# EAGLE design drumuino (EAGLE 7.6.0)
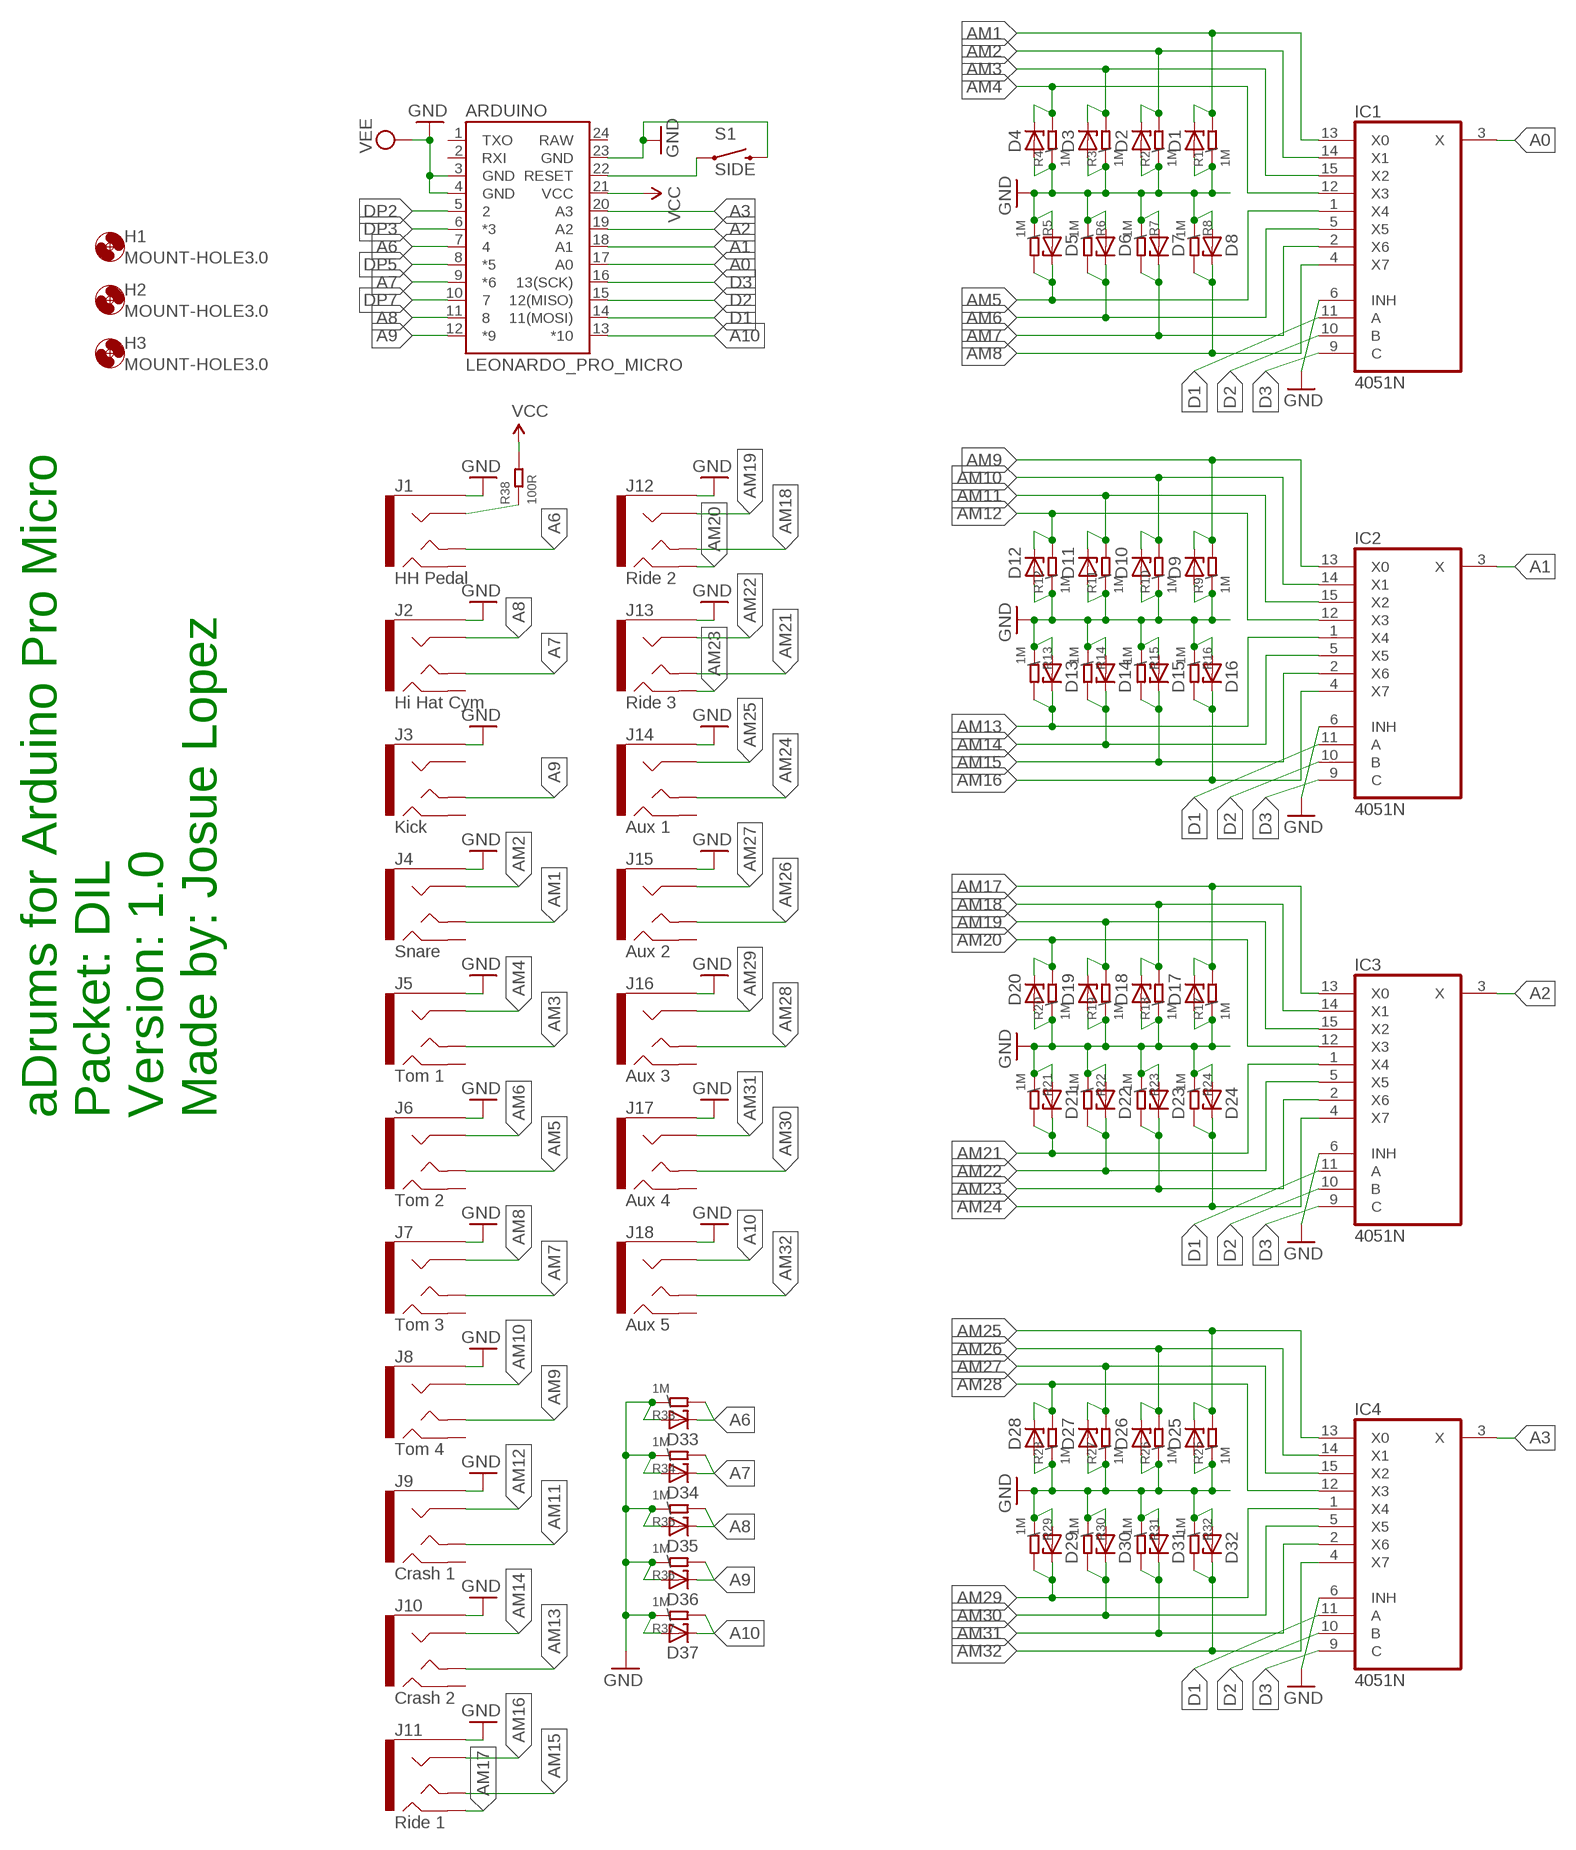
[diagram p0: schematic, sheet 1]

## Parts
ARDUINO  LEONARDO_PRO_MICRO  ARDUINO_PRO_MICRO  [ARDUINO_PRO_MICRO]
D1  \  ZENER-DIODEDO41-7.6  [DO41-7.6]
D2  \  ZENER-DIODEDO41-7.6  [DO41-7.6]
D3  \  ZENER-DIODEDO41-7.6  [DO41-7.6]
D4  \  ZENER-DIODEDO41-7.6  [DO41-7.6]
D5  \  ZENER-DIODEDO41-7.6  [DO41-7.6]
D6  \  ZENER-DIODEDO41-7.6  [DO41-7.6]
D7  \  ZENER-DIODEDO41-7.6  [DO41-7.6]
D8  \  ZENER-DIODEDO41-7.6  [DO41-7.6]
D9  \  ZENER-DIODEDO41-7.6  [DO41-7.6]
D10  \  ZENER-DIODEDO41-7.6  [DO41-7.6]
D11  \  ZENER-DIODEDO41-7.6  [DO41-7.6]
D12  \  ZENER-DIODEDO41-7.6  [DO41-7.6]
D13  \  ZENER-DIODEDO41-7.6  [DO41-7.6]
D14  \  ZENER-DIODEDO41-7.6  [DO41-7.6]
D15  \  ZENER-DIODEDO41-7.6  [DO41-7.6]
D16  \  ZENER-DIODEDO41-7.6  [DO41-7.6]
D17  \  ZENER-DIODEDO41-7.6  [DO41-7.6]
D18  \  ZENER-DIODEDO41-7.6  [DO41-7.6]
D19  \  ZENER-DIODEDO41-7.6  [DO41-7.6]
D20  \  ZENER-DIODEDO41-7.6  [DO41-7.6]
D21  \  ZENER-DIODEDO41-7.6  [DO41-7.6]
D22  \  ZENER-DIODEDO41-7.6  [DO41-7.6]
D23  \  ZENER-DIODEDO41-7.6  [DO41-7.6]
D24  \  ZENER-DIODEDO41-7.6  [DO41-7.6]
D25  \  ZENER-DIODEDO41-7.6  [DO41-7.6]
D26  \  ZENER-DIODEDO41-7.6  [DO41-7.6]
D27  \  ZENER-DIODEDO41-7.6  [DO41-7.6]
D28  \  ZENER-DIODEDO41-7.6  [DO41-7.6]
D29  \  ZENER-DIODEDO41-7.6  [DO41-7.6]
D30  \  ZENER-DIODEDO41-7.6  [DO41-7.6]
D31  \  ZENER-DIODEDO41-7.6  [DO41-7.6]
D32  \  ZENER-DIODEDO41-7.6  [DO41-7.6]
D33  \  ZENER-DIODEDO41-7.6  [DO41-7.6]
D34  \  ZENER-DIODEDO41-7.6  [DO41-7.6]
D35  \  ZENER-DIODEDO41-7.6  [DO41-7.6]
D36  \  ZENER-DIODEDO41-7.6  [DO41-7.6]
D37  \  ZENER-DIODEDO41-7.6  [DO41-7.6]
H1  MOUNT-HOLE3.0  [3,0]
H2  MOUNT-HOLE3.0  [3,0]
H3  MOUNT-HOLE3.0  [3,0]
IC1  4051N  [DIL16]
IC2  4051N  [DIL16]
IC3  4051N  [DIL16]
IC4  4051N  [DIL16]
J1  HH Pedal  AUDIO-JACK3'DIL'  [AUDIO-JACK-TRRS-DIL]
J2  Hi Hat Cym  AUDIO-JACK3'DIL'  [AUDIO-JACK-TRRS-DIL]
J3  Kick  AUDIO-JACK3'DIL'  [AUDIO-JACK-TRRS-DIL]
J4  Snare  AUDIO-JACK3'DIL'  [AUDIO-JACK-TRRS-DIL]
J5  Tom 1  AUDIO-JACK3'DIL'  [AUDIO-JACK-TRRS-DIL]
J6  Tom 2  AUDIO-JACK3'DIL'  [AUDIO-JACK-TRRS-DIL]
J7  Tom 3  AUDIO-JACK3'DIL'  [AUDIO-JACK-TRRS-DIL]
J8  Tom 4  AUDIO-JACK3'DIL'  [AUDIO-JACK-TRRS-DIL]
J9  Crash 1  AUDIO-JACK3'DIL'  [AUDIO-JACK-TRRS-DIL]
J10  Crash 2  AUDIO-JACK3'DIL'  [AUDIO-JACK-TRRS-DIL]
J11  Ride 1  AUDIO-JACK3'DIL'  [AUDIO-JACK-TRRS-DIL]
J12  Ride 2  AUDIO-JACK3'DIL'  [AUDIO-JACK-TRRS-DIL]
J13  Ride 3  AUDIO-JACK3'DIL'  [AUDIO-JACK-TRRS-DIL]
J14  Aux 1  AUDIO-JACK3'DIL'  [AUDIO-JACK-TRRS-DIL]
J15  Aux 2  AUDIO-JACK3'DIL'  [AUDIO-JACK-TRRS-DIL]
J16  Aux 3  AUDIO-JACK3'DIL'  [AUDIO-JACK-TRRS-DIL]
J17  Aux 4  AUDIO-JACK3'DIL'  [AUDIO-JACK-TRRS-DIL]
J18  Aux 5  AUDIO-JACK3'DIL'  [AUDIO-JACK-TRRS-DIL]
R1  1M  RES-0207/7  [R0207_7]
R2  1M  RES-0207/7  [R0207_7]
R3  1M  RES-0207/7  [R0207_7]
R4  1M  RES-0207/7  [R0207_7]
R5  1M  RES-0207/7  [R0207_7]
R6  1M  RES-0207/7  [R0207_7]
R7  1M  RES-0207/7  [R0207_7]
R8  1M  RES-0207/7  [R0207_7]
R9  1M  RES-0207/7  [R0207_7]
R10  1M  RES-0207/7  [R0207_7]
R11  1M  RES-0207/7  [R0207_7]
R12  1M  RES-0207/7  [R0207_7]
R13  1M  RES-0207/7  [R0207_7]
R14  1M  RES-0207/7  [R0207_7]
R15  1M  RES-0207/7  [R0207_7]
R16  1M  RES-0207/7  [R0207_7]
R17  1M  RES-0207/7  [R0207_7]
R18  1M  RES-0207/7  [R0207_7]
R19  1M  RES-0207/7  [R0207_7]
R20  1M  RES-0207/7  [R0207_7]
R21  1M  RES-0207/7  [R0207_7]
R22  1M  RES-0207/7  [R0207_7]
R23  1M  RES-0207/7  [R0207_7]
R24  1M  RES-0207/7  [R0207_7]
R25  1M  RES-0207/7  [R0207_7]
R26  1M  RES-0207/7  [R0207_7]
R27  1M  RES-0207/7  [R0207_7]
R28  1M  RES-0207/7  [R0207_7]
R29  1M  RES-0207/7  [R0207_7]
R30  1M  RES-0207/7  [R0207_7]
R31  1M  RES-0207/7  [R0207_7]
R32  1M  RES-0207/7  [R0207_7]
R33  1M  RES-0207/7  [R0207_7]
R34  1M  RES-0207/7  [R0207_7]
R35  1M  RES-0207/7  [R0207_7]
R36  1M  RES-0207/7  [R0207_7]
R37  1M  RES-0207/7  [R0207_7]
R38  100R  RES-0207/7  [R0207_7]
S1  SIDE  SWITCH-MOMENTARY-2SIDE_EZ  [TACTILE-PTH-SIDEEZ]

## Nets
A0: ARDUINO.17(A0) IC1.3(X)
A1: ARDUINO.18(A1) IC2.3(X)
A2: ARDUINO.19(A2) IC3.3(X)
A3: ARDUINO.20(A3) IC4.3(X)
A6: ARDUINO.7 D33.C J1.TIP R33.2
A7: ARDUINO.9(*6) D34.C J2.TIP R34.2
A8: ARDUINO.11 D35.C J2.RING1 R35.2
A9: ARDUINO.12(*9) D36.C J3.TIP R36.2
A10: ARDUINO.13(*10) D37.C J18.RING1 R37.2
AM1: D1.C IC1.13(X0) J4.TIP R1.2
AM2: D2.C IC1.14(X1) J4.RING1 R2.2
AM3: D3.C IC1.15(X2) J5.TIP R3.2
AM4: D4.C IC1.12(X3) J5.RING1 R4.2
AM5: D5.C IC1.1(X4) J6.TIP R5.2
AM6: D6.C IC1.5(X5) J6.RING1 R6.2
AM7: D7.C IC1.2(X6) J7.TIP R7.2
AM8: D8.C IC1.4(X7) J7.RING1 R8.2
AM9: D9.C IC2.13(X0) J8.TIP R9.2
AM10: D10.C IC2.14(X1) J8.RING1 R10.2
AM11: D11.C IC2.15(X2) J9.TIP R11.2
AM12: D12.C IC2.12(X3) J9.RING1 R12.2
AM13: D13.C IC2.1(X4) J10.TIP R13.2
AM14: D14.C IC2.5(X5) J10.RING1 R14.2
AM15: D15.C IC2.2(X6) J11.TIP R15.2
AM16: D16.C IC2.4(X7) J11.RING1 R16.2
AM17: D17.C IC3.13(X0) J11.RING2 R17.2
AM18: D18.C IC3.14(X1) J12.TIP R18.2
AM19: D19.C IC3.15(X2) J12.RING1 R19.2
AM20: D20.C IC3.12(X3) J12.RING2 R20.2
AM21: D21.C IC3.1(X4) J13.TIP R21.2
AM22: D22.C IC3.5(X5) J13.RING1 R22.2
AM23: D23.C IC3.2(X6) J13.RING2 R23.2
AM24: D24.C IC3.4(X7) J14.TIP R24.2
AM25: D25.C IC4.13(X0) J14.RING1 R25.2
AM26: D26.C IC4.14(X1) J15.TIP R26.2
AM27: D27.C IC4.15(X2) J15.RING1 R27.2
AM28: D28.C IC4.12(X3) J16.TIP R28.2
AM29: D29.C IC4.1(X4) J16.RING1 R29.2
AM30: D30.C IC4.5(X5) J17.TIP R30.2
AM31: D31.C IC4.2(X6) J17.RING1 R31.2
AM32: D32.C IC4.4(X7) J18.TIP R32.2
D1: ARDUINO.14(11(MOSI)) IC1.11(A) IC2.11(A) IC3.11(A) IC4.11(A)
D2: ARDUINO.15(12(MISO)) IC1.10(B) IC2.10(B) IC3.10(B) IC4.10(B)
D3: ARDUINO.16(13(SCK)) IC1.9(C) IC2.9(C) IC3.9(C) IC4.9(C)
DP2: ARDUINO.5
DP3: ARDUINO.6(*3)
DP5: ARDUINO.8(*5)
DP7: ARDUINO.10
GND [Supply]: ARDUINO.3(GND) ARDUINO.4(GND) ARDUINO.23(GND) D1.A D2.A D3.A D4.A D5.A D6.A D7.A D8.A D9.A D10.A D11.A D12.A D13.A D14.A D15.A D16.A D17.A D18.A D19.A D20.A D21.A D22.A D23.A D24.A D25.A D26.A D27.A D28.A D29.A D30.A D31.A D32.A D33.A D34.A D35.A D36.A D37.A IC1.6(INH) IC2.6(INH) IC3.6(INH) IC4.6(INH) J1.2EARTH(EARTH) J1.EARTH J2.2EARTH(EARTH) J2.EARTH J3.2EARTH(EARTH) J3.EARTH J4.2EARTH(EARTH) J4.EARTH J5.2EARTH(EARTH) J5.EARTH J6.2EARTH(EARTH) J6.EARTH J7.2EARTH(EARTH) J7.EARTH J8.2EARTH(EARTH) J8.EARTH J9.2EARTH(EARTH) J9.EARTH J10.2EARTH(EARTH) J10.EARTH J11.2EARTH(EARTH) J11.EARTH J12.2EARTH(EARTH) J12.EARTH J13.2EARTH(EARTH) J13.EARTH J14.2EARTH(EARTH) J14.EARTH J15.2EARTH(EARTH) J15.EARTH J16.2EARTH(EARTH) J16.EARTH J17.2EARTH(EARTH) J17.EARTH J18.2EARTH(EARTH) J18.EARTH R1.1 R2.1 R3.1 R4.1 R5.1 R6.1 R7.1 R8.1 R9.1 R10.1 R11.1 R12.1 R13.1 R14.1 R15.1 R16.1 R17.1 R18.1 R19.1 R20.1 R21.1 R22.1 R23.1 R24.1 R25.1 R26.1 R27.1 R28.1 R29.1 R30.1 R31.1 R32.1 R33.1 R34.1 R35.1 R36.1 R37.1 S1.2 ; supply symbol labelled VEE
HHC_TIP: J1.RING1 R38.1
N$1: ARDUINO.22(RESET) S1.1
VCC [Supply]: ARDUINO.21(VCC) R38.2
Unconnected: ARDUINO.1(TXO) ARDUINO.2(RXI) ARDUINO.24(RAW) J1.RING2 J2.RING2 J3.RING1 J3.RING2 J4.RING2 J5.RING2 J6.RING2 J7.RING2 J8.RING2 J9.RING2 J10.RING2 J14.RING2 J15.RING2 J16.RING2 J17.RING2 J18.RING2

## Notes on the sheet
- aDrums for Arduino Pro Micro
  Packet: DIL
  Version: 1.0
  Made by: Josue Lopez

## Power pins joined to a net without a drawn wire
GND: IC1.7(VEE) IC1.8(GND) IC2.7(VEE) IC2.8(GND) IC3.7(VEE) IC3.8(GND) IC4.7(VEE) IC4.8(GND)
VCC: IC1.16(VCC) IC2.16(VCC) IC3.16(VCC) IC4.16(VCC)

## Library data of the parts
ARDUINO = SparkFun-Boards:ARDUINO_PRO_MICRO
D1-D37 = diode:ZENER-DIODE: Z-Diode
H1-H3 = holes:MOUNT-HOLE: MOUNTING HOLE with drill center marker
IC1-IC4 = 40xx:4051: 8-channel ANALOG MULTIPLEXER
J1-J18 = SparkFun-Connectors:AUDIO-JACK3: 3.5mm Female Audio Connector 6 Pin DIP Stereo Headphone Jack PJ-313B
R1-R38 = Seeed-OPL-Resistor:RES
S1 = SparkFun-Electromechanical:SWITCH-MOMENTARY-2: Various NO switches- pushbuttons, reed, etc

## Net classes
0 default: width 0.635 mm
1 Supply: width 1.016 mm

## Board
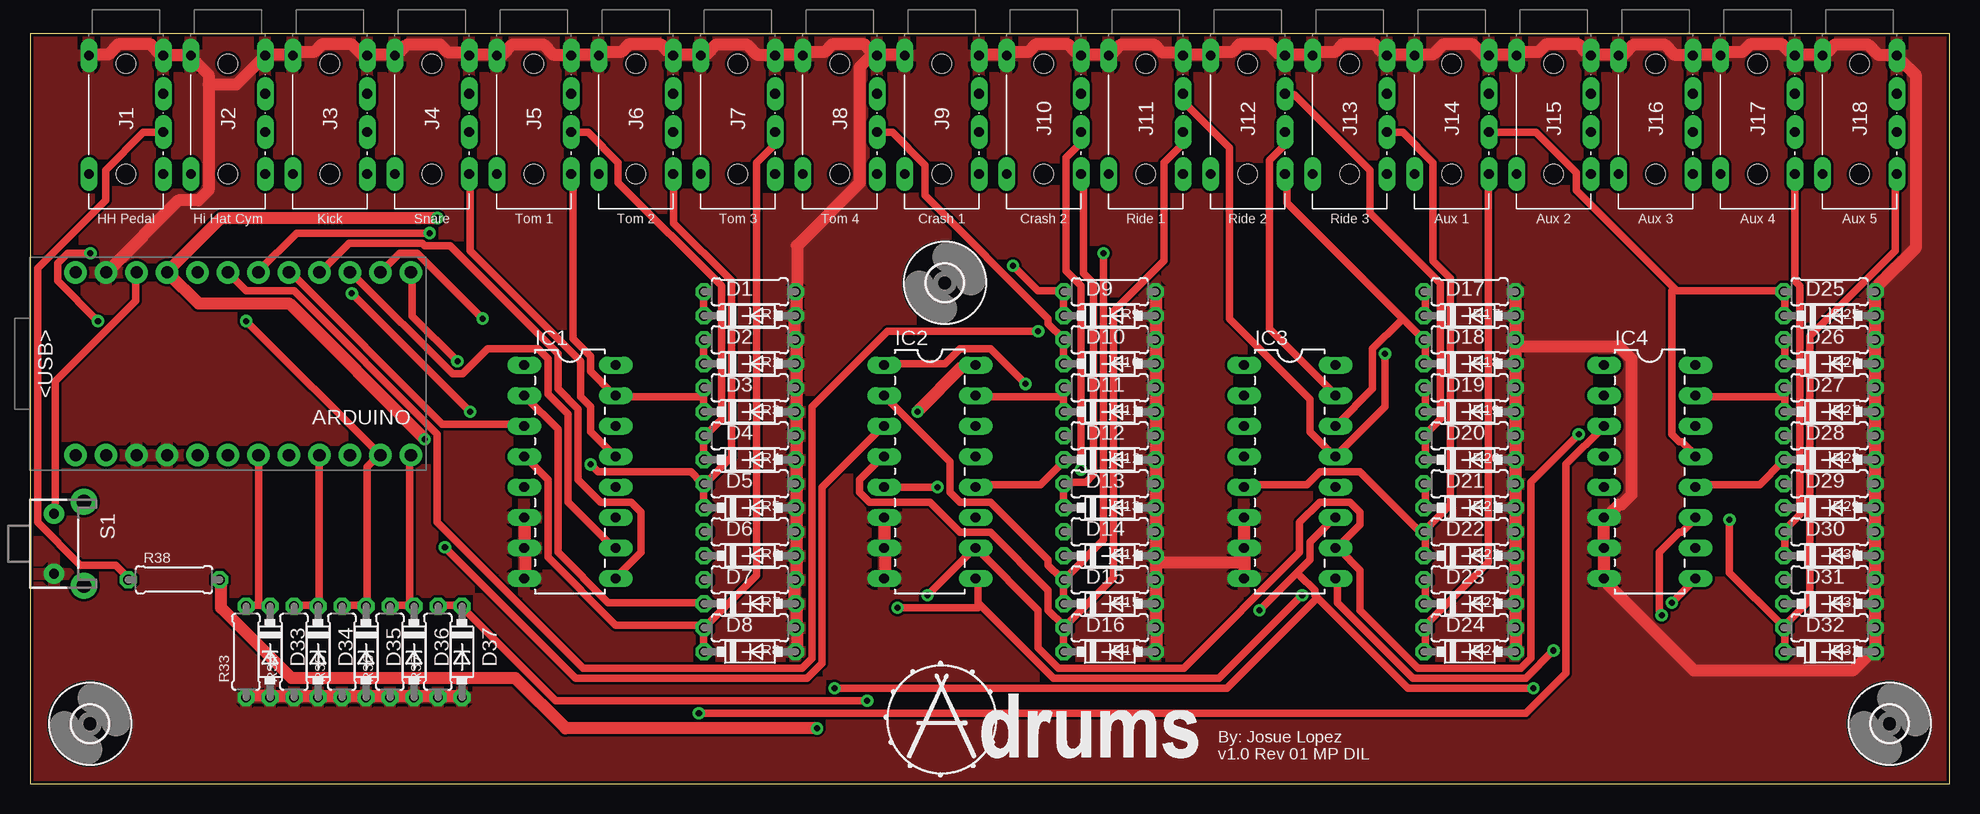
[diagram p1: board, top side]
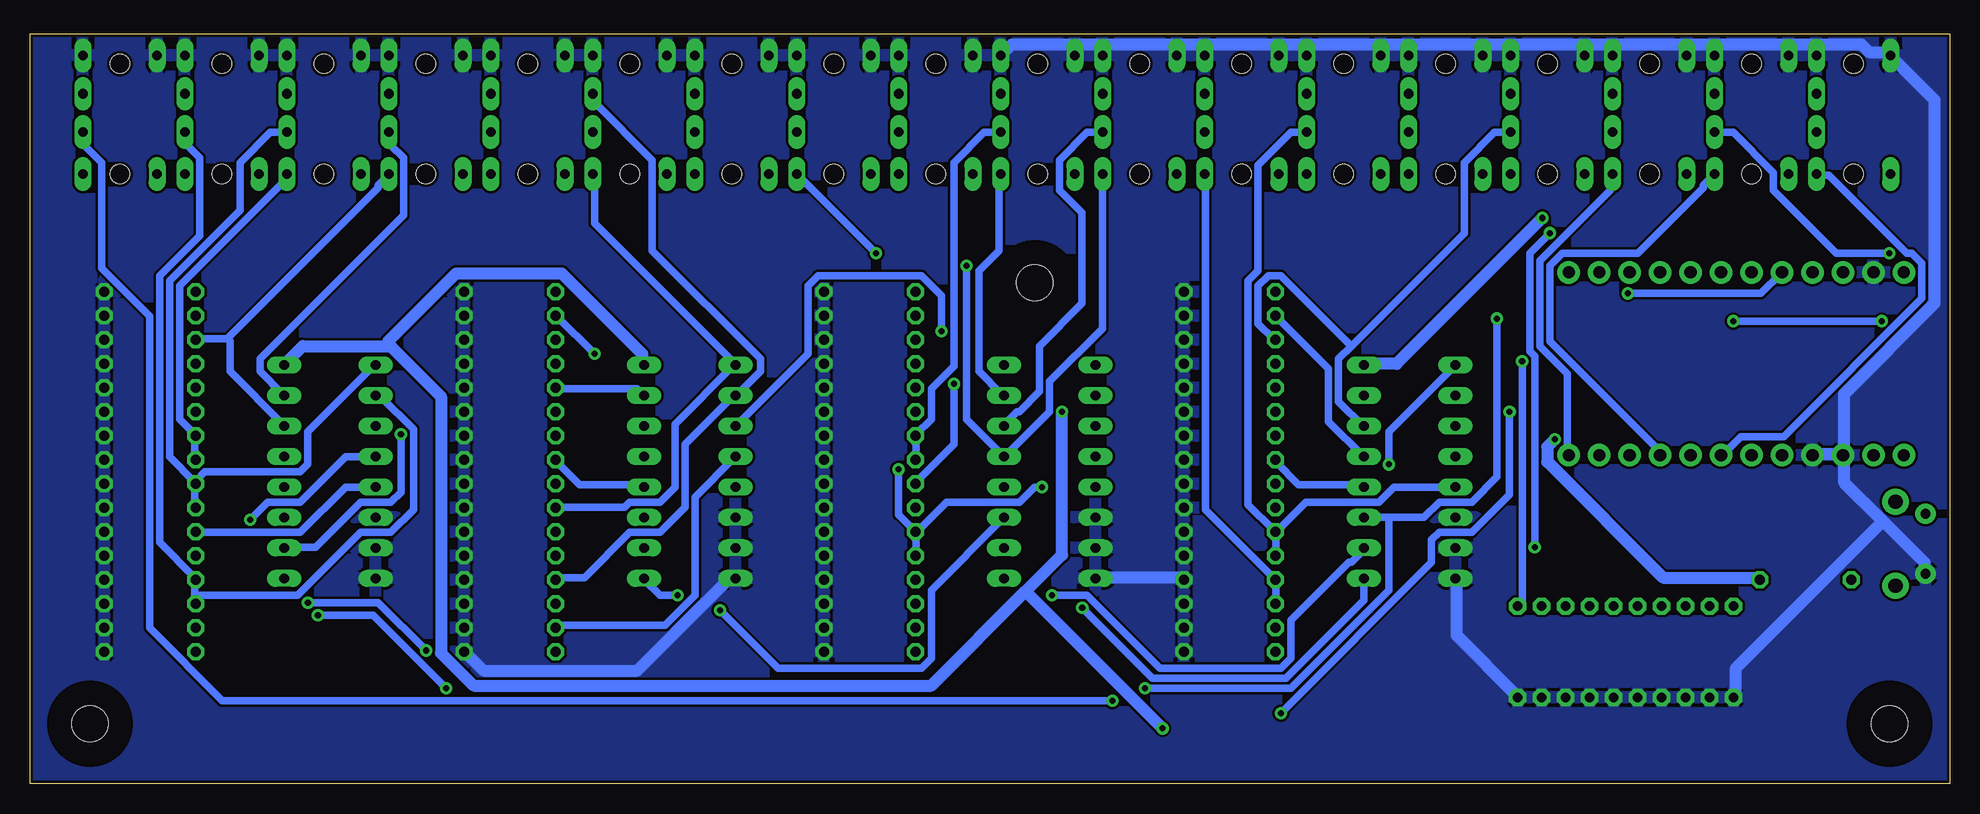
[diagram p2: board, bottom side, seen from below]

Size 160 x 62.5 mm. Coordinates in mm from the lower left corner, seen from the top.
Outline: 0,0 160,0 160,62.5 0,62.5 0,0
Copper layers (1*16): Top 0.035mm / dielectric 1.5mm / Bottom 0.035mm
Design rules "SparkFun": minimum track width 8mil, minimum drill 20mil, track to track 8mil, track to pad 8mil, pad to pad 8mil, via to via 8mil, smd to smd 8mil, copper to edge 10mil, drill to drill 8mil, minimum pad ring 12mil, minimum via ring 10mil, stop-mask expansion 4mil, vias tented up to drill 25mil, thermal gap 10mil

### Footprints (pad centres in the part's own frame; a part is rotated, then mirrored left to right if it is on the bottom)
ARDUINO_PRO_MICRO = drill 1.016 pad 1.88: 1 -7.62,12.7; 2 -7.62,10.16; 3 -7.62,7.62; 4 -7.62,5.08; 5 -7.62,2.54; 6 -7.62,0; 7 -7.62,-2.54; 8 -7.62,-5.08; 9 -7.62,-7.62; 10 -7.62,-10.16; 11 -7.62,-12.7; 12 -7.62,-15.24; 13 7.62,-15.24; 14 7.62,-12.7; 15 7.62,-10.16; 16 7.62,-7.62; 17 7.62,-5.08; 18 7.62,-2.54; 19 7.62,0; 20 7.62,2.54; 21 7.62,5.08; 22 7.62,7.62; 23 7.62,10.16; 24 7.62,12.7
DO41-7.6 = drill 0.813 octagon: A 3.81,0; C -3.81,0
3,0 = hole 3: 0,0
DIL16 = drill 0.813 long: 1 -8.89,-3.81; 2 -6.35,-3.81; 3 -3.81,-3.81; 4 -1.27,-3.81; 5 1.27,-3.81; 6 3.81,-3.81; 7 6.35,-3.81; 8 8.89,-3.81; 9 8.89,3.81; 10 6.35,3.81; 11 3.81,3.81; 12 1.27,3.81; 13 -1.27,3.81; 14 -3.81,3.81; 15 -6.35,3.81; 16 -8.89,3.81
AUDIO-JACK-TRRS-DIL = drill 0.8 long: 2EARTH 1.8,-3.1; 2TIP 11.7,-3.1; EARTH 1.8,3.1; RING1 8.2,3.1; RING2 5,3.1; TIP 11.7,3.1 | hole 1.6: 2.5,0; 11.7,0
R0207_7 = drill 0.813 octagon: 1 -3.81,0; 2 3.81,0
TACTILE-PTH-SIDEEZ = drill 0.8 pad 1.7: 1 -2.5,0; 2 2.5,0 | drill 1.2 pad 2.2: ANCHOR1 -3.5,2.5; ANCHOR2 3.5,2.5

### Placement (x,y rotation side)
ARDUINO  16.5,35 90 top
D1  60,39 0 top
D2  60,35 0 top
D3  60,31 0 top
D4  60,27 0 top
D5  60,23 0 top
D6  60,19 0 top
D7  60,15 0 top
D8  60,11 0 top
D9  90,39 0 top
D10  90,35 0 top
D11  90,31 0 top
D12  90,27 0 top
D13  90,23 0 top
D14  90,19 0 top
D15  90,15 0 top
D16  90,11 0 top
D17  120,39 0 top
D18  120,35 0 top
D19  120,31 0 top
D20  120,27 0 top
D21  120,23 0 top
D22  120,19 0 top
D23  120,15 0 top
D24  120,11 0 top
D25  150,39 0 top
D26  150,35 0 top
D27  150,31 0 top
D28  150,27 0 top
D29  150,23 0 top
D30  150,19 0 top
D31  150,15 0 top
D32  150,11 0 top
D33  20,11 270 top
D34  24,11 270 top
D35  28,11 270 top
D36  32,11 270 top
D37  36,11 270 top
H1  5,5 0 top
H2  155,5 0 top
H3  76.25,41.74 0 top
IC1  45,26 270 top
IC2  75,26 270 top
IC3  105,26 270 top
IC4  135,26 270 top
J1  8,62.5 270 top
J2  16.5,62.5 270 top
J3  25,62.5 270 top
J4  33.5,62.5 270 top
J5  42,62.5 270 top
J6  50.5,62.5 270 top
J7  59,62.5 270 top
J8  67.5,62.5 270 top
J9  76,62.5 270 top
J10  84.5,62.5 270 top
J11  93,62.5 270 top
J12  101.5,62.5 270 top
J13  110,62.5 270 top
J14  118.5,62.5 270 top
J15  127,62.5 270 top
J16  135.5,62.5 270 top
J17  144,62.5 270 top
J18  152.5,62.5 270 top
R1  60,41 180 top
R2  60,37 180 top
R3  60,33 180 top
R4  60,29 180 top
R5  60,25 180 top
R6  60,21 180 top
R7  60,17 180 top
R8  60,13 180 top
R9  90,41 180 top
R10  90,37 180 top
R11  90,33 180 top
R12  90,29 180 top
R13  90,25 180 top
R14  90,21 180 top
R15  90,17 180 top
R16  90,13 180 top
R17  120,41 180 top
R18  120,37 180 top
R19  120,33 180 top
R20  120,29 180 top
R21  120,25 180 top
R22  120,21 180 top
R23  120,17 180 top
R24  120,13 180 top
R25  150,41 180 top
R26  150,37 180 top
R27  150,33 180 top
R28  150,29 180 top
R29  150,25 180 top
R30  150,21 180 top
R31  150,17 180 top
R32  150,13 180 top
R33  18,11 90 top
R34  22,11 90 top
R35  26,11 90 top
R36  30,11 90 top
R37  34,11 90 top
R38  12,17 0 top
S1  2,20 270 top

### Tracks (layer width: path | path; a pad name or v marks a point on that pad's centre or on a via)
A0
  Top 0.635: IC1.3 41.07,29.97 34.37,29.97 21.58,42.75 ARDUINO.17
A1  (via drill 0.51)
  Top 0.635: v34.58,19.7 45.47,8.8 64.75,8.8 66.01,10.06 66.01,24.73 71.04,29.76 IC2.3 | v33.32,45.89 22.21,45.89 19.07,42.75 ARDUINO.18
  Bottom 0.635: v34.58,19.7 34.58,35.62 34.99,36.04 34.99,44.22 v33.32,45.89
A2  (via drill 0.51)
  Top 0.635: v84.03,37.72 71.46,37.72 65.17,31.43 65.17,10.48 64.33,9.64 46.1,9.64 33.95,21.79 33.95,29.13 22,41.07 18.02,41.07 16.55,42.54 ARDUINO.19
  Bottom 0.635: v84.03,37.72 84.03,40.65 85.71,42.33 94.3,42.33 95.14,41.49 95.14,35.83 101,29.97 IC3.3
A3  (via drill 0.51)
  Top 0.635: v55.74,5.87 124.68,5.87 128.03,9.22 128.03,26.61 131.18,29.76 IC4.3 | v26.82,40.86 v36.67,31.01
  Bottom 0.635: v55.74,5.87 43.17,18.44 43.17,20.33 42.54,20.95 39.81,20.95 36.67,24.1 v36.67,31.01 | v26.82,40.86 15.72,40.86 14.04,42.54 ARDUINO.20
A6
  Top 0.635: 19.07,14.88 19.91,14.88 D33.C | 19.07,14.88 18.02,14.88 R33.2 | 19.07,14.88 19.07,15.09 19.07,27.24 ARDUINO.7
  Bottom 0.635: J1.TIP 10.9,50.71 10.06,50.71 3.56,44.22 3.14,44.22 2.31,43.38 2.31,40.44 13.83,28.92 17.39,28.92 18.86,27.45 ARDUINO.7
A7
  Top 0.635: R34.2 22,14.88 23.89,14.88 D34.C 24.1,15.09 24.1,27.24 ARDUINO.9
  Bottom 0.635: J2.TIP 19.7,50.71 20.54,49.87 20.54,49.66 25.98,44.22 32.27,44.22 33.32,43.17 33.32,36.88 24.31,27.87 24.31,27.45 ARDUINO.9
A8  (via drill 0.51)
  Top 0.635: R35.2 26.19,14.88 27.87,14.88 D35.C 28.08,15.09 28.08,26.4 28.92,27.24 ARDUINO.11 29.13,27.45 v18.02,38.56 | v5.03,44.22 3.14,44.22 2.31,43.38 2.31,41.91 v5.66,38.56
  Bottom 0.635: v5.03,44.22 9.43,44.22 14.67,49.45 14.67,50.92 18.02,54.27 19.49,54.27 J2.RING1 | v18.02,38.56 v5.66,38.56
A9
  Top 0.635: R36.2 30.18,14.88 31.85,14.88 D36.C 31.64,15.09 31.64,27.24 ARDUINO.12
  Bottom 0.635: J3.TIP 28.29,50.71 28.29,49.45 34.16,43.59 34.16,36.46 31.85,34.16 31.85,27.45 ARDUINO.12
A10  (via drill 0.51)
  Top 0.635: v69.78,6.92 43.8,6.92 36.04,14.67 D37.C 35.83,14.88 34.16,14.88 R37.2 | v35.62,35.2 31.85,38.98 31.85,42.54 ARDUINO.13
  Bottom 0.635: v69.78,6.92 143.96,6.92 150.04,12.99 150.04,38.98 154.02,42.96 154.02,51.76 155.49,53.23 155.49,54.27 J18.RING1 | v35.62,35.2 35.62,15.09 35.83,14.88 D37.C
AM1
  Top 0.635: D1.C 56.16,39.19 56.16,40.86 R1.2 | J4.TIP 36.67,50.71 36.67,44.42 45.89,35.2 45.89,32.27 46.73,31.43 46.73,29.34 48.62,27.45 IC1.13
  Bottom 0.635: D1.C 56.16,38.98 51.76,34.58 51.76,30.18 48.83,27.24 IC1.13
AM2
  Top 0.635: D2.C 56.16,35.2 56.16,36.88 R2.2
  Bottom 0.635: 49.87,36.46 50.92,35.41 50.92,31.85 48.83,29.76 IC1.14 | 49.87,36.46 40.44,45.89 40.44,51.76 37.93,54.27 36.67,54.27 J4.RING1 | R2.2 56.37,37.09 57.63,38.35 57.63,41.49 56.79,42.33 55.74,42.33 50.08,36.67 49.87,36.46
AM3
  Top 0.635: 56.16,32.27 56.16,32.9 R3.2 | 56.16,32.27 56.16,31.01 D3.C | J5.TIP 45.26,50.71 45.26,37.09 46.73,35.62 46.73,34.37 48.62,32.48 IC1.15 49.03,32.27 55.95,32.27 56.16,32.27
AM4
  Top 0.635: J5.RING1 45.26,54.27 46.52,54.27 49.03,51.76 49.03,50.08 57.63,41.49 57.63,30.39 56.37,29.13 R4.2 56.16,28.71 56.16,27.03 D4.C
  Bottom 0.635: IC1.12 48.83,24.94 54.27,24.94 56.16,26.82 D4.C
AM5  (via drill 0.51)
  Top 0.635: J6.TIP 53.65,50.71 53.65,46.73 58.46,41.91 58.46,27.24 56.37,25.15 R5.2 | D5.C 56.16,23.05 56.16,24.73 R5.2 | v46.73,26.61 47.36,25.98 55.11,25.98 55.95,25.15 R5.2
  Bottom 0.635: v46.73,26.61 46.73,29.34 41.28,34.78 IC1.1
AM6
  Bottom 0.635: J6.RING1 53.65,54.27 54.9,54.27 57.63,51.55 57.63,42.75 58.46,41.91 58.46,23.26 56.37,21.16 R6.2 | D6.C 56.16,19.07 56.16,20.75 R6.2 | IC1.5 41.28,24.73 46.31,24.73 47.57,23.47 53.65,23.47 55.95,21.16 R6.2
AM7
  Top 0.635: IC1.2 41.28,32.27 44.01,29.55 44.01,19.28 48.2,15.09 56.16,15.09 D7.C
  Bottom 0.635: J7.TIP 62.03,50.71 62.03,22.84 56.37,17.18 R7.2 56.16,16.76 56.16,15.09 D7.C
AM8
  Top 0.635: J7.RING1 62.03,54.27 62.03,53.23 60.56,51.76 60.56,17.39 56.37,13.2 R8.2 | IC1.4 41.28,27.24 43.17,25.36 43.17,18.86 48.83,13.2 55.95,13.2 R8.2 | D8.C 56.16,11.11 56.16,12.78 R8.2
AM9  (via drill 0.51)
  Top 0.635: D9.C 86.12,39.19 86.12,40.86 R9.2 85.92,41.07 84.03,41.07 v81.93,43.17
  Bottom 0.635: J8.TIP 70.62,50.71 70.62,37.93 75.02,33.53 75.02,31.01 78.79,27.24 IC2.13 79,27.45 81.93,30.39 v81.93,43.17
AM10
  Top 0.635: J8.RING1 70.62,54.27 71.88,54.27 74.6,51.55 74.6,49.03 84.87,38.77 84.87,38.35 86.12,37.09 R10.2 86.12,36.88 86.12,35.2 D10.C
  Bottom 0.635: IC2.14 78.79,29.97 77.74,31.01 77.53,31.01 75.86,32.69 75.86,36.46 72.3,40.02 72.3,47.57 74.18,49.45 74.18,51.97 71.88,54.27 70.62,54.27 J8.RING1
AM11
  Top 0.635: 86.12,32.27 86.12,32.9 R11.2 | 86.12,32.27 86.12,31.01 D11.C | 86.12,32.27 85.92,32.27 79,32.27 IC2.15
  Bottom 0.635: J9.TIP 79.21,50.71 79.21,44.42 80.89,42.75 80.89,34.37 79,32.48 IC2.15
AM12
  Top 0.635: IC2.12 79,24.94 84.24,24.94 86.12,26.82 D12.C
  Bottom 0.635: J9.RING1 79.21,54.27 80.47,54.27 82.98,51.76 82.98,34.78 84.87,32.9 84.87,30.39 86.12,29.13 R12.2 86.12,28.71 86.12,27.03 D12.C
AM13  (via drill 0.51)
  Top 0.635: J10.TIP 87.8,50.71 87.8,42.54 88.64,41.7 88.64,25.77 88.01,25.15 86.33,25.15 R13.2 86.12,24.73 86.12,23.05 D13.C | v82.98,33.32 80.05,36.25 77.53,36.25 76.28,34.99 71.25,34.99 IC2.1
  Bottom 0.635: v82.98,33.32 82.98,28.29 86.12,25.15 R13.2
AM14  (via drill 0.51)
  Top 0.635: v87.59,26.19 87.59,41.49 86.33,42.75 86.33,52.18 87.59,53.44 87.59,54.27 J10.RING1 | v75.65,24.73 71.25,24.73 IC2.5
  Bottom 0.635: v87.59,26.19 87.59,22.42 86.33,21.16 R14.2 | D14.C 86.12,19.07 86.12,20.75 R14.2 | v75.65,24.73 76.28,24.73 77.53,23.47 83.61,23.47 85.92,21.16 R14.2
AM15  (via drill 0.51)
  Top 0.635: v89.48,44.22 89.48,20.33 86.33,17.18 R15.2 | D15.C 86.12,15.09 86.12,16.76 R15.2 | IC2.2 71.25,32.27 76.69,26.82 76.69,24.31 77.53,23.47 80.05,23.47 84.87,18.65 84.87,18.23 85.92,17.18 R15.2
  Bottom 0.635: v89.48,44.22 95.97,50.71 J11.TIP
AM16
  Top 0.635: J11.RING1 95.97,54.27 95.97,53.23 94.51,51.76 94.51,43.59 90.32,39.4 90.32,17.18 86.33,13.2 R16.2 | D16.C 86.12,11.11 86.12,12.78 R16.2 | IC2.4 71.04,27.24 69.15,25.36 69.15,24.31 69.99,23.47 75.02,23.47 77.53,20.95 80.05,20.95 84.87,16.14 84.87,14.46 86.12,13.2 R16.2
AM17  (via drill 0.51)
  Top 0.635: D17.C 116.3,39.19 116.3,40.86 R17.2 | J11.RING2 96.18,57.42 96.18,56.79 99.95,53.02 99.95,38.77 106.66,32.06 106.66,29.34 108.76,27.24 IC3.13 108.97,27.45 112.95,31.43 v112.95,35.83
  Bottom 0.635: v112.95,35.83 116.09,38.98 D17.C
AM18
  Top 0.635: 114.41,38.77 116.09,37.09 R18.2 116.3,36.88 116.3,35.2 D18.C | 114.41,38.77 104.78,48.41 104.78,50.71 J12.TIP | IC3.14 108.97,29.97 111.9,32.9 111.9,36.25 114.2,38.56 114.41,38.77
AM19
  Top 0.635: D19.C 116.3,31.01 116.3,32.9 R19.2 | J12.RING1 104.56,54.27 104.56,53.23 103.31,51.97 103.31,37.93 108.76,32.48 IC3.15
  Bottom 0.635: R19.2 116.09,32.9 109.39,32.9 108.97,32.48 IC3.15
AM20
  Top 0.635: J12.RING2 104.78,57.42 105.4,57.42 111.69,51.13 111.69,47.57 117.56,41.7 117.56,30.39 116.3,29.13 R20.2 116.3,28.71 116.3,27.03 D20.C
  Bottom 0.635: IC3.12 108.97,24.94 114.2,24.94 116.09,26.82 D20.C
AM21
  Top 0.635: D21.C 116.3,23.05 116.3,24.94 R21.2
  Bottom 0.635: J13.TIP 112.95,50.71 112.95,46.73 101.21,34.99 IC3.1 101.42,34.78 106.24,29.97 106.24,24.73 107.5,23.47 110.01,23.47 110.43,23.05 116.09,23.05 D21.C
AM22
  Top 0.635: J13.RING1 113.16,54.27 114.41,54.27 116.93,51.76 116.93,43.59 118.4,42.12 118.4,23.26 116.3,21.16 R22.2 | D22.C 116.3,19.07 116.3,20.75 R22.2 | IC3.5 101.21,24.94 106.45,24.94 107.5,25.98 110.85,25.98 115.88,20.95 R22.2
AM23
  Top 0.635: D23.C 116.3,15.09 116.3,16.97 R23.2
  Bottom 0.635: J13.RING2 112.95,57.42 112.95,56.79 108.13,51.97 108.13,44.42 99.12,35.41 99.12,34.37 101,32.48 IC3.2 101.42,32.27 105.4,28.29 105.4,23.05 107.5,20.95 110.01,20.95 113.79,17.18 116.09,17.18 R23.2
AM24
  Top 0.635: J14.TIP 121.54,50.71 121.54,18.44 116.3,13.2 R24.2 116.3,12.78 116.3,11.11 D24.C
  Bottom 0.635: IC3.4 101.21,27.24 104.56,23.89 104.56,15.72 107.08,13.2 116.09,13.2 R24.2
AM25
  Top 0.635: 137.05,41.28 137.25,41.07 146.06,41.07 R25.2 146.27,40.86 146.27,39.19 D25.C | 137.05,41.28 128.87,49.45 128.87,50.92 125.52,54.27 121.75,54.27 J14.RING1 | IC4.13 138.72,27.45 137.67,28.5 137.47,28.5 136.84,29.13 136.84,41.07 137.05,41.28
AM26
  Top 0.635: D26.C 146.27,35.2 146.27,36.88 R26.2
  Bottom 0.635: 143.54,37.09 130.97,49.66 130.97,49.87 130.13,50.71 J15.TIP | 143.54,37.09 146.06,37.09 R26.2 | IC4.14 138.93,29.97 143.33,34.37 143.33,36.88 143.54,37.09
AM27
  Top 0.635: 146.27,32.27 146.27,32.9 R27.2 | 146.27,32.27 146.27,31.01 D27.C | 146.27,32.27 146.06,32.27 138.93,32.27 IC4.15
  Bottom 0.635: J15.RING1 129.92,54.27 129.92,53.23 128.87,52.18 128.87,47.36 140.82,35.41 140.82,34.37 138.93,32.48 IC4.15
AM28
  Top 0.635: IC4.12 138.93,24.94 144.17,24.94 146.06,26.82 D28.C
  Bottom 0.635: J16.TIP 138.72,50.71 138.72,50.29 147.52,41.49 147.52,30.39 146.27,29.13 R28.2 146.27,28.71 146.27,27.03 D28.C
AM29
  Bottom 0.635: J16.RING1 138.72,54.27 139.98,54.27 142.49,51.76 142.49,47.78 148.36,41.91 148.36,27.24 146.27,25.15 R29.2 | D29.C 146.27,23.05 146.27,24.73 R29.2 | IC4.1 131.39,34.78 136.84,29.34 136.84,26.61 137.47,25.98 145.43,25.98 146.06,25.36 R29.2
AM30
  Top 0.635: J17.TIP 147.1,50.71 147.1,41.91 147.52,41.49 147.52,22.42 146.27,21.16 R30.2 146.27,20.75 146.27,19.07 D30.C
  Bottom 0.635: IC4.5 131.39,24.73 133.69,24.73 137.47,20.95 146.06,20.95 R30.2
AM31
  Bottom 0.635: J17.RING1 146.9,54.27 146.9,53.23 145.85,52.18 145.85,45.68 149.2,42.33 149.2,20.12 146.27,17.18 R31.2 146.27,16.76 146.27,15.72 | 146.27,15.72 146.27,15.09 D31.C | IC4.2 131.18,32.27 130.76,32.27 128.03,29.55 128.03,22.84 129.92,20.95 132.44,20.95 137.67,15.72 146.06,15.72 146.27,15.72
AM32  (via drill 0.51)
  Top 0.635: J18.TIP 155.49,50.71 155.49,44.42 148.36,37.3 148.36,15.3 146.27,13.2 R32.2 | v141.66,22 141.66,17.6 146.06,13.2 R32.2 | D32.C 146.27,11.11 146.27,12.78 R32.2
  Bottom 0.635: v141.66,22 140.19,23.47 137.47,23.47 133.69,27.24 131.39,27.24 IC4.4
D1  (via drill 0.51)
  Top 0.635: v37.72,38.77 32.27,44.22 30.8,44.22 29.34,42.75 ARDUINO.14 | 105.61,17.6 106.66,18.65 106.66,20.12 108.76,22.21 IC3.11 | 105.61,17.6 v102.47,14.46 | v136,14.04 135.79,14.25 135.79,19.28 137.47,20.95 137.67,20.95 138.72,22 IC4.11 | v125.31,7.96 114.83,7.96 107.29,15.51 | 107.29,15.51 107.08,15.72 107.08,16.14 105.82,17.39 105.61,17.6 | v67.06,7.96 99.75,7.96 107.08,15.3 107.29,15.51
  Bottom 0.635: 46.73,22.21 43.8,22.21 42.54,23.47 39.81,23.47 37.72,25.57 v37.72,38.77 | 46.73,22.21 48.62,22.21 IC1.11 | v102.47,14.46 97.65,9.64 85.71,9.64 84.87,10.48 84.87,16.14 79,22 IC2.11 | v136,14.04 131.39,14.04 v125.31,7.96 | v67.06,7.96 54.9,7.96 46.73,16.14 46.73,22 46.73,22.21
D2  (via drill 0.51)
  Top 0.635: IC1.10 48.62,19.7 44.84,23.47 44.84,30.8 43.17,32.48 43.17,35.41 42.33,36.25 38.14,36.25 36.04,34.16 35.2,34.16 26.82,42.54 ARDUINO.15 | v129.08,29.13 125.1,25.15 125.1,10.48 124.26,9.64 115.67,9.64 110.85,14.46 110.85,17.81 109.18,19.49 IC3.10 108.97,19.7 110.85,21.58 110.85,22.63 110.01,23.47 107.5,23.47 105.82,21.79 105.82,19.28 96.18,9.64 85.71,9.64 84.03,11.32 84.03,14.46 79,19.49 IC2.10 78.58,19.49 v74.81,15.72
  Bottom 0.635: v129.08,29.13 129.08,24.31 129.92,23.47 132.44,23.47 136.21,19.7 138.72,19.7 IC4.10 | v74.81,15.72 71.88,15.72 65.8,9.64 55.74,9.64 54.9,10.48 54.9,13.62 50.08,18.44 49.87,18.44 48.83,19.49 IC1.10
D3  (via drill 0.51)
  Top 0.635: IC1.9 48.83,17.18 50.92,19.28 50.92,22.63 50.08,23.47 47.57,23.47 45.68,25.36 45.68,31.22 44.01,32.9 44.01,35.83 34.99,44.84 32.9,44.84 32.69,45.05 26.61,45.05 24.31,42.75 ARDUINO.16 | 79.21,14.88 85.29,8.8 99.12,8.8 v106.03,15.72 | 79.21,14.88 79,15.09 79,16.97 IC2.9 | v136.84,15.09 138.72,16.97 IC4.9 | v126.99,11.11 124.68,8.8 115.25,8.8 108.97,15.09 108.97,16.97 IC3.9 | v72.3,14.67 79,14.67 79.21,14.88
  Bottom 0.635: v106.03,15.72 107.5,15.72 108.76,16.97 IC3.9 | v136.84,15.09 130.97,15.09 v126.99,11.11 | v72.3,14.67 66.43,8.8 55.32,8.8 48.83,15.3 48.83,16.97 IC1.9
GND
  Top 1.016: IC1.8 41.28,17.18 41.28,19.49 IC1.7 41.28,20.12 41.28,22 IC1.6 | R33.1 18.02,7.33 19.91,7.33 D33.A 20.33,7.33 21.79,7.33 R34.1 22.42,7.33 23.89,7.33 D34.A 24.52,7.33 25.98,7.33 R35.1 26.4,7.33 27.87,7.33 D35.A 28.5,7.33 29.97,7.33 R36.1 30.39,7.33 31.85,7.33 D36.A 32.48,7.33 33.95,7.33 R37.1 34.37,7.33 35.83,7.33 D37.A | IC2.8 71.25,17.18 71.25,19.49 IC2.7 71.25,20.12 71.25,22 IC2.6 | D8.A 63.91,11.11 63.91,12.99 R8.1 63.91,13.41 63.91,14.88 D7.A 63.7,15.51 63.7,16.97 R7.1 63.91,17.39 63.91,18.86 D6.A 63.91,19.49 63.91,20.95 R6.1 63.91,21.37 63.91,22.84 D5.A 63.91,23.47 63.91,24.94 R5.1 63.91,25.36 63.91,26.82 D4.A 63.91,27.45 63.91,28.92 R4.1 63.91,29.34 63.91,30.8 D3.A 63.91,31.43 63.91,32.9 R3.1 63.91,33.32 63.91,34.99 D2.A 63.91,35.41 63.91,36.88 R2.1 63.7,37.51 63.7,38.98 D1.A 63.91,39.4 63.91,40.86 R1.1 63.91,41.49 63.91,44.84 69.15,50.08 69.15,59.72 69.99,60.56 J8.EARTH | J1.2EARTH 5.03,60.77 6.5,60.77 7.33,61.61 10.06,61.61 10.9,60.77 J1.EARTH 11.53,60.77 13.2,60.77 J2.2EARTH 13.62,60.35 14.88,59.09 14.88,58.26 | 14.88,58.26 14.88,49.45 14.04,48.62 12.36,48.62 6.5,42.75 ARDUINO.23 | J8.EARTH 70.62,60.77 72.71,60.77 J9.2EARTH | J8.EARTH 70.2,60.98 69.57,61.61 66.85,61.61 66.22,60.98 64.75,60.98 J8.2EARTH 64.33,60.77 62.24,60.77 J7.EARTH 61.61,60.77 60.56,60.77 59.72,61.61 57.21,61.61 56.37,60.77 J7.2EARTH 55.74,60.77 53.65,60.77 J6.EARTH 53.23,60.98 52.6,61.61 49.87,61.61 49.24,60.98 47.78,60.98 J6.2EARTH 47.36,60.77 45.26,60.77 J5.EARTH 44.63,60.77 43.59,60.77 42.75,61.61 40.23,61.61 39.4,60.77 J5.2EARTH 38.77,60.77 36.67,60.77 J4.EARTH 36.25,60.98 34.78,60.98 34.16,61.61 31.43,61.61 30.8,60.98 J4.2EARTH 30.39,60.77 28.29,60.77 J3.EARTH 27.66,60.77 26.82,61.61 24.31,61.61 23.68,60.98 22.21,60.98 J3.2EARTH 21.79,60.77 19.7,60.77 J2.EARTH 19.28,60.35 17.18,58.26 15.3,58.26 14.88,58.26
  Top 1.016: 101.21,18.44 101.21,19.49 IC3.7 101.21,20.12 101.21,22 IC3.6 | 101.21,18.44 101.21,17.18 IC3.8 | D16.A 93.88,11.11 93.88,12.99 R16.1 93.88,13.41 93.88,14.88 D15.A 93.88,15.51 93.88,16.97 R15.1 93.88,17.39 93.88,18.44 | 93.88,18.44 93.88,18.86 D14.A 93.88,19.49 93.88,20.95 R14.1 93.88,21.37 93.88,22.84 D13.A 93.88,23.47 93.88,24.94 R13.1 93.88,25.36 93.88,26.82 D12.A 93.88,27.45 93.88,28.92 R12.1 93.88,29.34 93.88,30.8 D11.A 93.88,31.43 93.88,32.9 R11.1 93.88,33.32 93.88,34.99 D10.A 93.88,35.41 93.88,36.88 R10.1 93.88,37.3 93.88,38.98 D9.A 93.88,39.4 93.88,40.86 R9.1 | 101.21,18.44 100.79,18.44 94.3,18.44 93.88,18.44 | D24.A 123.84,11.11 123.84,12.99 R24.1 123.84,13.41 123.84,14.88 D23.A 123.84,15.51 123.84,16.97 R23.1 123.84,17.39 123.84,18.86 D22.A 123.84,19.49 123.84,20.95 R22.1 123.84,21.37 123.84,22.84 D21.A 123.84,23.47 123.84,24.94 R21.1 123.84,25.36 123.84,26.82 D20.A 123.84,27.45 123.84,28.92 R20.1 123.84,29.34 123.84,30.8 D19.A 123.84,31.43 123.84,32.9 R19.1 123.84,33.53 123.84,34.99 D18.A 123.84,35.41 123.84,36.88 R18.1 | R18.1 123.84,37.51 123.84,38.98 D17.A 123.84,39.4 123.84,40.86 R17.1 | R18.1 124.26,36.46 132.44,36.46 133.48,35.41 133.48,24.1 132.65,23.26 132.44,23.26 131.6,22.42 IC4.6 131.18,22 131.18,20.12 IC4.7 131.18,19.49 131.18,17.18 IC4.8 131.39,16.76 138.72,9.43 151.92,9.43 153.39,10.9 D32.A 153.81,11.11 R32.1 153.81,13.41 153.81,14.88 D31.A 153.81,15.51 153.81,16.97 R31.1 153.81,17.39 153.81,18.86 D30.A 153.81,19.49 153.81,20.95 R30.1 153.81,21.37 153.81,22.84 D29.A 153.81,23.47 153.81,24.94 R29.1 153.81,25.36 153.81,26.82 D28.A 153.81,27.45 153.81,28.92 R28.1 153.81,29.34 153.81,30.8 D27.A 153.81,31.43 153.81,32.9 R27.1 153.81,33.32 D26.A 153.81,35.41 153.81,36.88 R26.1 153.81,37.3 153.81,38.98 D25.A 153.81,39.4 153.81,40.86 R25.1 154.02,41.49 157.16,44.63 157.16,59.09 155.91,60.35 J18.EARTH 155.49,60.77 154.02,60.77 153.18,61.61 150.46,61.61 149.83,60.98 J18.2EARTH 149.2,60.77 147.1,60.77 J17.EARTH 146.69,60.98 146.06,61.61 143.33,61.61 142.7,60.98 141.24,60.98 J17.2EARTH 140.82,60.77 138.72,60.77 J16.EARTH 138.09,60.77 137.05,60.77 136.21,61.61 133.69,61.61 132.85,60.77 J16.2EARTH 132.23,60.77 130.13,60.77 J15.EARTH 129.71,60.98 129.08,61.61 126.36,61.61 125.73,60.98 124.26,60.98 J15.2EARTH 123.84,60.77 121.75,60.77 J14.EARTH 121.12,60.77 120.28,61.61 117.77,61.61 116.93,60.77 115.88,60.77 J14.2EARTH 115.25,60.77 113.16,60.77 J13.EARTH 112.74,60.98 112.11,61.61 109.39,61.61 108.76,60.98 107.29,60.98 J13.2EARTH 106.87,60.77 104.78,60.77 J12.EARTH 104.15,60.77 103.31,61.61 100.79,61.61 100.17,60.98 98.7,60.98 J12.2EARTH 98.28,60.77 96.18,60.77 J11.EARTH 95.76,60.98 94.3,60.98 93.67,61.61 90.94,61.61 90.32,60.98 J11.2EARTH 89.9,60.77 87.8,60.77 J10.EARTH 87.17,60.98 86.54,61.61 83.82,61.61 83.19,60.98 81.72,60.98 J10.2EARTH 81.31,60.77 79.21,60.77 J9.EARTH
  Bottom 1.016: 5.55,21.9 8.8,25.15 8.8,27.24 ARDUINO.3 | 5.55,21.9 2.1,18.44 2.1,17.6 S1.2 | ARDUINO.4 11.32,27.45 9.22,27.45 ARDUINO.3 | IC1.8 41.07,16.97 41.07,12.36 36.04,7.33 D37.A | 5.55,21.9 5.87,21.58 17.81,9.64 17.81,7.33 R33.1 | IC2.8 71.04,17.18 63.91,17.18 R7.1 | ARDUINO.3 8.8,27.87 8.8,32.48 1.26,40.02 1.26,57 4.82,60.56 J1.2EARTH 5.24,60.98 6.71,60.98 7.33,61.61 78.16,61.61 79,60.77 J9.EARTH | IC3.8 101.21,16.97 101.84,16.97 109.39,9.43 122.17,9.43 123.64,10.9 D24.A
  pour Top (isolate 0.012): 0,0 0,62.5 160,62.5 160,0
  pour Bottom (isolate 0.012): 0,0 0,62.5 160,62.5 160,0
HHC_TIP
  Top 0.635: J1.RING1 10.9,54.27 9.43,54.27 6.29,51.13 6.29,48.62 0.63,42.96 0.63,21.79 4.19,18.23 7.12,18.23 8.17,17.18 R38.1
N$1
  Top 0.635: S1.1 2.1,22.63 2.1,33.53 8.8,40.23 8.8,42.54 ARDUINO.22
VCC  (via drill 0.51)
  Top 1.016: v32.9,28.71 21.58,40.02 14.04,40.02 11.53,42.54 ARDUINO.21 11.73,42.96 15.93,47.15 v33.95,47.15 | v73.97,31.01 77.74,34.78 78.79,34.78 IC2.16 | v65.59,4.61 44.63,4.61 40.44,8.8 21.79,8.8 15.93,14.67 15.93,16.97 R38.2
  Bottom 1.016: v32.9,28.71 33.53,28.08 33.53,26.82 23.89,17.18 15.93,17.18 R38.2 | v33.95,47.15 46.1,34.99 48.62,34.99 IC1.16 | v73.97,31.01 73.97,19.07 77.01,16.03 | 77.01,16.03 84.87,8.17 123.01,8.17 125.73,10.9 125.73,32.27 129.92,36.46 | 129.92,36.46 137.25,36.46 138.72,34.99 IC4.16 | IC3.16 108.97,34.99 108.97,35.83 115.67,42.54 124.47,42.54 130.13,36.88 129.92,36.46 | v65.59,4.61 76.69,15.72 77.01,16.03

### Text on the board
tPlace: By: Josue Lopez / v1.0 Rev 01 MP DIL